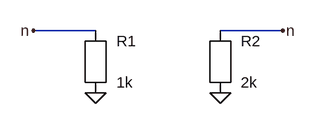
[diagram p0: schematic same_name_labels.asc]
same_name_labels.asc, the LTspice schematic file:
Version 4
SHEET 1 880 680
WIRE 0 96 96 96
WIRE 288 96 384 96
SYMBOL res 96 144 R0
SYMATTR InstName R1
SYMATTR Value 1k
SYMBOL res 288 144 R0
SYMATTR InstName R2
SYMATTR Value 2k
FLAG 96 192 0
FLAG 288 192 0
FLAG 0 96 n
FLAG 384 96 n

The netlist it stands for:
* same_name_labels.asc
R1 n 0 1k
R2 n 0 2k
.backanno
.end